# Altium schematic sheet Perifericos_Schematic.SchDoc
size A4
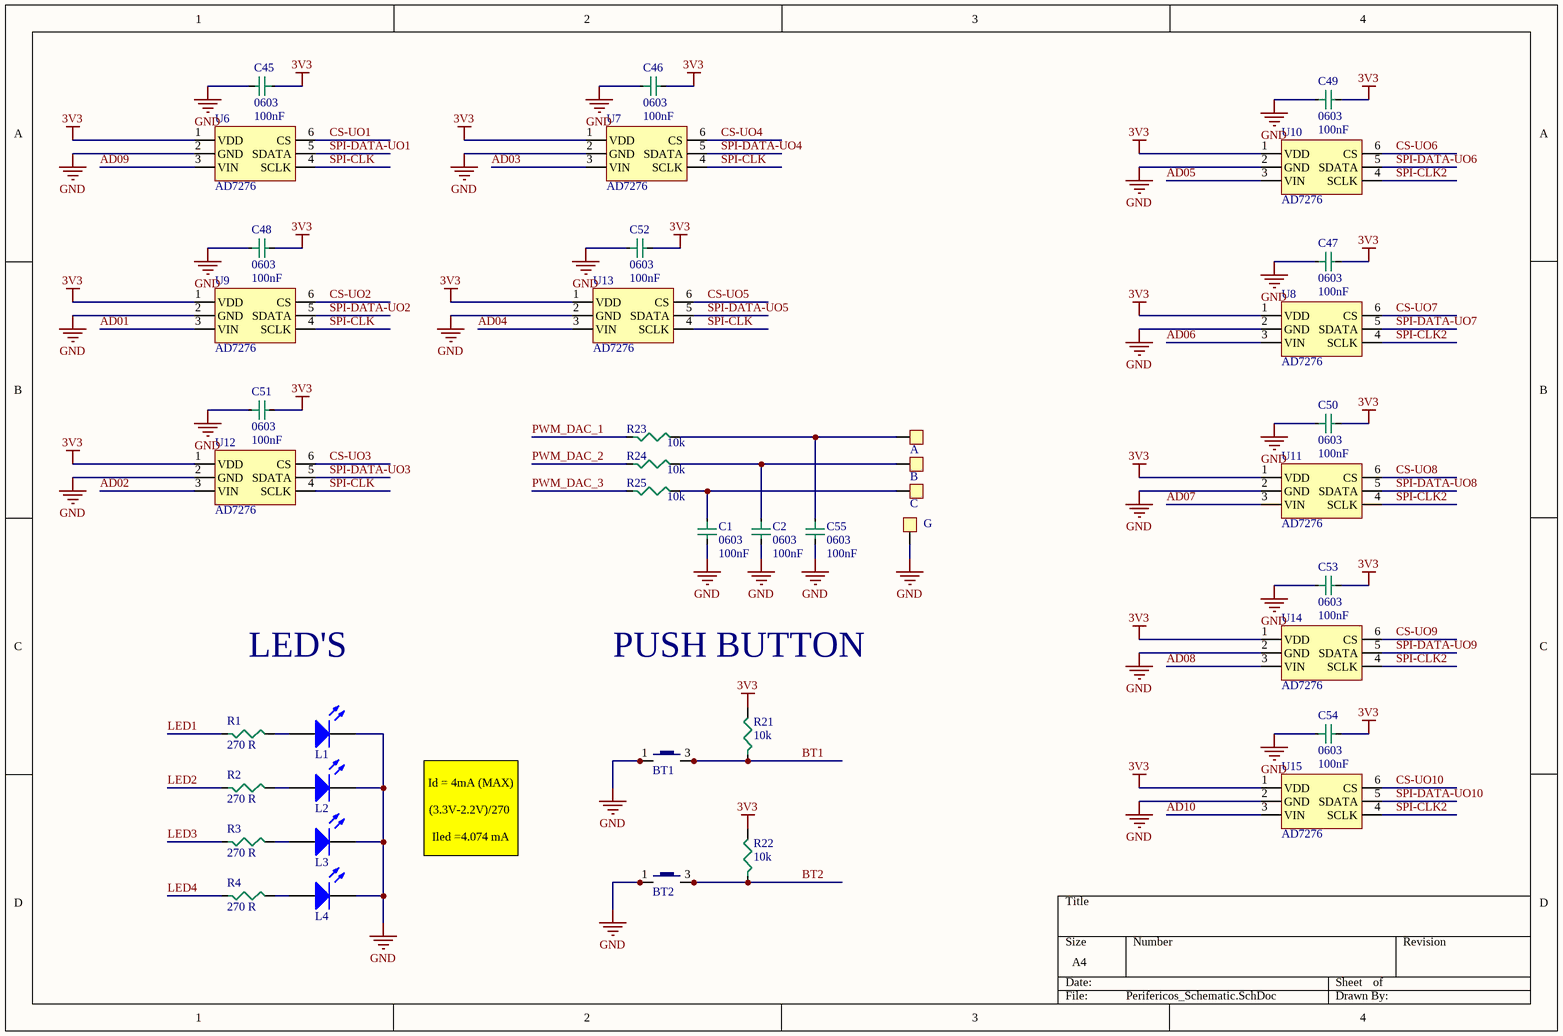
[diagram p0: Perifericos_Schematic.SchDoc]

## Parts
A  TEST POINT PC MINI .040"D, 0.010" x 0.020" (0.25mm x 0.51mm)  [PC test RED]  (value not drawn)
B  TEST POINT PC MINI .040"D, 0.010" x 0.020" (0.25mm x 0.51mm)  [PC test GREEN]  (value not drawn)
BT1  BOTAO SMD_MENOR  [BOTAO SMD - MENOR]  (value not drawn)
BT2  BOTAO SMD_MENOR  [BOTAO SMD - MENOR]  (value not drawn)
C  TEST POINT PC MINI .040"D, 0.010" x 0.020" (0.25mm x 0.51mm)  [PC test BLUE]  (value not drawn)
C1  0603  value 100nF  [0603C]
C2  0603  value 100nF  [0603C]
C45  0603  value 100nF  [0603C]
C46  0603  value 100nF  [0603C]
C47  0603  value 100nF  [0603C]
C48  0603  value 100nF  [0603C]
C49  0603  value 100nF  [0603C]
C50  0603  value 100nF  [0603C]
C51  0603  value 100nF  [0603C]
C52  0603  value 100nF  [0603C]
C53  0603  value 100nF  [0603C]
C54  0603  value 100nF  [0603C]
C55  0603  value 100nF  [0603C]
G  TEST POINT PC MINI .040"D, 0.010" x 0.020" (0.25mm x 0.51mm)  [PC test BLACK]  (value not drawn)
L1  LED 0603  [LED SMD 0603]  (value not drawn)
L2  LED 0805  [LED SMD 0603]  (value not drawn)
L3  LED 0805  [LED SMD 0603]  (value not drawn)
L4  LED 0805  [LED SMD 0603]  (value not drawn)
R1  value 270 R  [0603]  (hidden comment: 0603)
R2  value 270 R  [0603]  (hidden comment: 0805)
R3  value 270 R  [0603]  (hidden comment: 0805)
R4  value 270 R  [0603]  (hidden comment: 0805)
R21  value 10k  [0603]  (hidden comment: 0603)
R22  value 10k  [0603]  (hidden comment: 0603)
R23  value 10k  [0603]  (hidden comment: 0603)
R24  value 10k  [0603]  (hidden comment: 0603)
R25  value 10k  [0603]  (hidden comment: 0603)
U6  AD7276  [SOT23-6]
U7  AD7276  [SOT23-6]
U8  AD7276  [SOT23-6]
U9  AD7276  [SOT23-6]
U10  AD7276  [SOT23-6]
U11  AD7276  [SOT23-6]
U12  AD7276  [SOT23-6]
U13  AD7276  [SOT23-6]
U14  AD7276  [SOT23-6]
U15  AD7276  [SOT23-6]

## Nets
3V3: C45.1 C46.2 C47.2 C48.2 C49.2 C50.2 C51.2 C52.2 C53.2 C54.2 R21.2 R22.2 U6.1(VDD) U7.1(VDD) U8.1(VDD) U9.1(VDD) U10.1(VDD) U11.1(VDD) U12.1(VDD) U13.1(VDD) U14.1(VDD) U15.1(VDD)
GND: BT1.1 BT1.2 BT2.1 BT2.2 C1.2 C2.2 C45.2 C46.1 C47.1 C48.1 C49.1 C50.1 C51.1 C52.1 C53.1 C54.1 C55.2 G.1 L1.2(K) L2.2(K) L3.2(K) L4.2(K) U6.2(GND) U7.2(GND) U8.2(GND) U9.2(GND) U10.2(GND) U11.2(GND) U12.2(GND) U13.2(GND) U14.2(GND) U15.2(GND)
AD01: U9.3(VIN)
AD02: U12.3(VIN)
AD03: U7.3(VIN)
AD04: U13.3(VIN)
AD05: U10.3(VIN)
AD06: U8.3(VIN)
AD07: U11.3(VIN)
AD08: U14.3(VIN)
AD09: U6.3(VIN)
AD10: U15.3(VIN)
BT1: BT1.3 BT1.4 R21.1
BT2: BT2.3 BT2.4 R22.1
CS-UO1: U6.6(CS)
CS-UO2: U9.6(CS)
CS-UO3: U12.6(CS)
CS-UO4: U7.6(CS)
CS-UO5: U13.6(CS)
CS-UO6: U10.6(CS)
CS-UO7: U8.6(CS)
CS-UO8: U11.6(CS)
CS-UO9: U14.6(CS)
CS-UO10: U15.6(CS)
LED1: R1.1
LED2: R2.1
LED3: R3.1
LED4: R4.1
PWM_DAC_1: R23.1
PWM_DAC_2: R24.1
PWM_DAC_3: R25.1
SPI-CLK: U6.4(SCLK) U7.4(SCLK) U9.4(SCLK) U12.4(SCLK) U13.4(SCLK)
SPI-CLK2: U8.4(SCLK) U10.4(SCLK) U11.4(SCLK) U14.4(SCLK) U15.4(SCLK)
SPI-DATA-UO1: U6.5(SDATA)
SPI-DATA-UO2: U9.5(SDATA)
SPI-DATA-UO3: U12.5(SDATA)
SPI-DATA-UO4: U7.5(SDATA)
SPI-DATA-UO5: U13.5(SDATA)
SPI-DATA-UO6: U10.5(SDATA)
SPI-DATA-UO7: U8.5(SDATA)
SPI-DATA-UO8: U11.5(SDATA)
SPI-DATA-UO9: U14.5(SDATA)
SPI-DATA-UO10: U15.5(SDATA)
NetA_1: A.1 C55.1 R23.2
NetB_1: B.1 C2.1 R24.2
NetC_1: C.1 C1.1 R25.2
NetL1_1: L1.1(A) R1.2
NetL2_1: L2.1(A) R2.2
NetL3_1: L3.1(A) R3.2
NetL4_1: L4.1(A) R4.2

## Notes on the sheet
- LED'S
- (near R21) PUSH BUTTON
- Id = 4mA (MAX)
  (3.3V-2.2V)/270
  Iled =4.074 mA

## Library data of the parts
A B C G = Test Point Keystone: PC Test Point, Miniature Phosphor Bronze, Silver Plating 0.040" (1.02mm) Hole Diameter Mounting Type; ComponentLink1Description: Digikey; ComponentLink1URL: https://www.digikey.com/product-detail/en/keystone-electronics/5000/36-5000-ND/255326
BT1 BT2 = BOTAO SMD_MENOR: SWITCH TACTILE SPST-NO 0.05A 32V; Supplier 1: Digi-Key; Supplier Part Number 1: CKN10244CT-ND
C1 C2 C45-C55 = Capacitor SMD 0603
L1-L4 = LED 0603 SMD: Typical INFRARED GaAs LED; Published: 8-Jun-2000; LatestRevisionDate: 08-Jul-2005; LatestRevisionNote: Mech Layer 1 removed.; PackageReference: LED-0; Publisher: Altium Limited
R1-R4 R21-R25 = Resistor SMD 0603 1/10 W: %: ±1%; P: 1/8W
U6-U15 = AD7276AUJZ-500RL7: IC ADC 12BIT 3MSPS 6TSOT; Supplier 1: Digi-Key; Supplier Part Number 1: AD7276AUJZ-500RL7CT-ND